# Altium schematic sheet RFDesign.SchDoc
size Letter
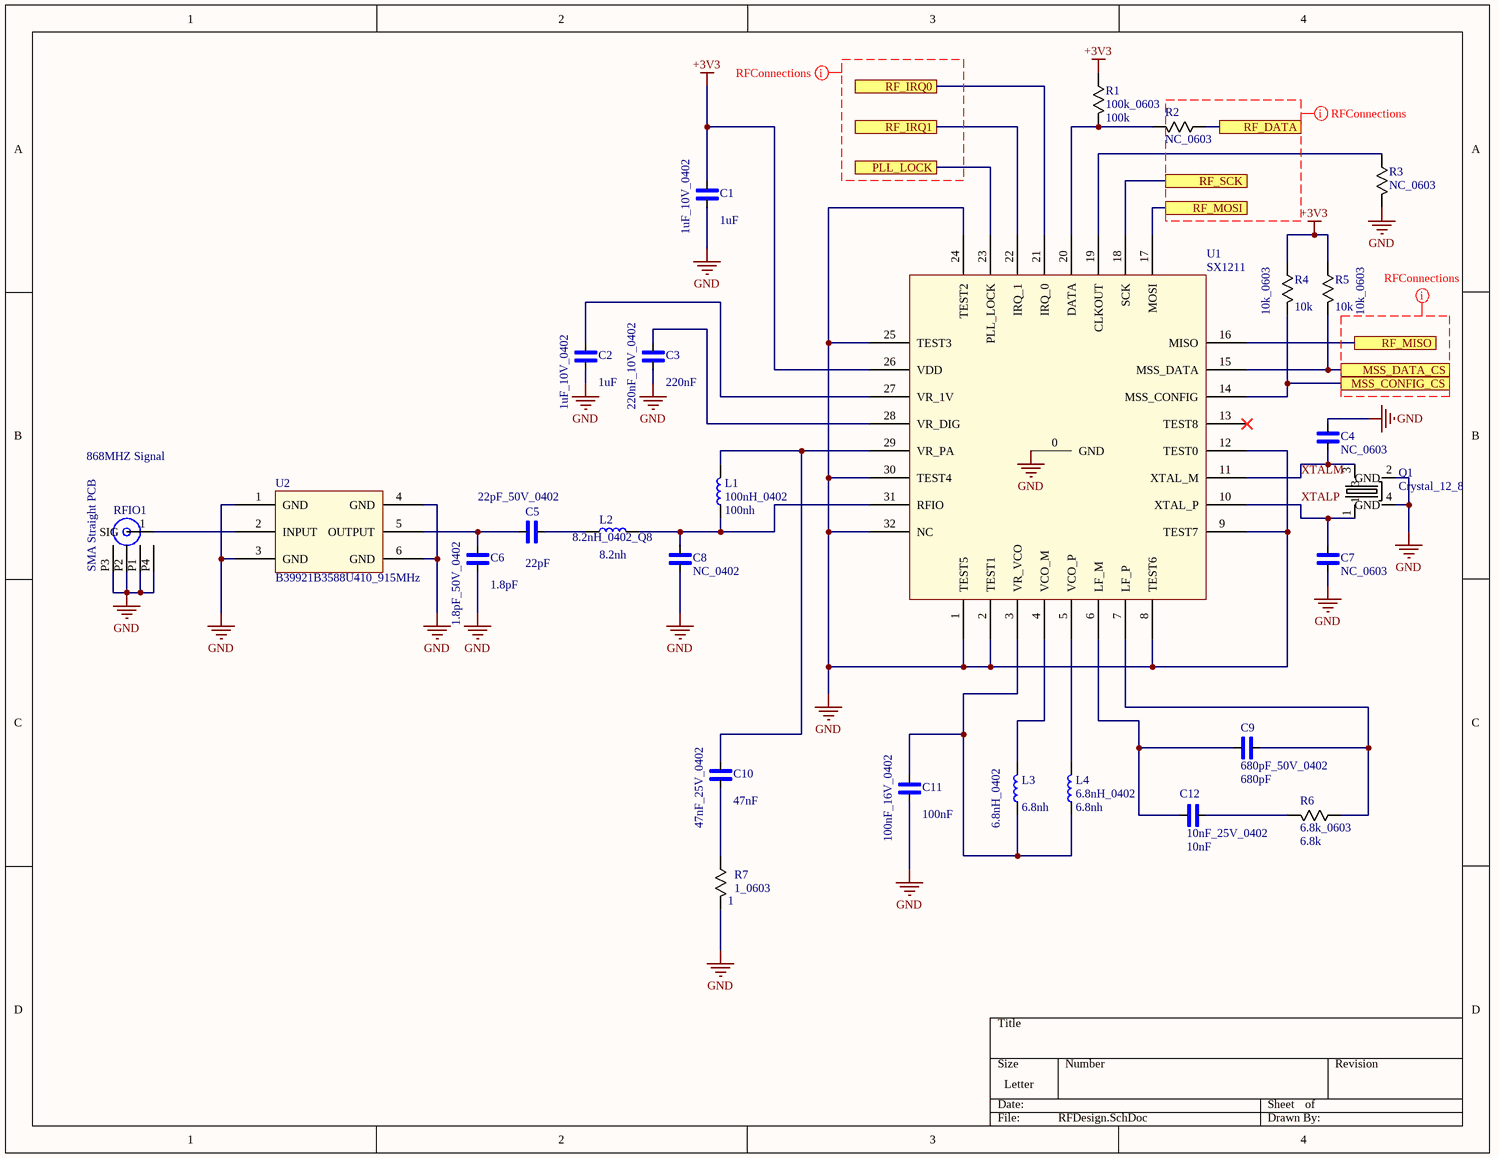
[diagram p0: RFDesign.SchDoc]

## Parts
C1  1uF_10V_0402  Capacitance: 1uF  [0402]
C2  1uF_10V_0402  Capacitance: 1uF  [0402]
C3  220nF_10V_0402  Capacitance: 220nF  [0402]
C4  NC_0603  [0603]
C5  22pF_50V_0402  Capacitance: 22pF  [0402]
C6  1.8pF_50V_0402  Capacitance: 1.8pF  [0402]
C7  NC_0603  [0603]
C8  NC_0402  [0402]
C9  680pF_50V_0402  Capacitance: 680pF  [0402]
C10  47nF_25V_0402  Capacitance: 47nF  [0402]
C11  100nF_16V_0402  Capacitance: 100nF  [0402]
C12  10nF_25V_0402  Capacitance: 10nF  [0402]
L1  100nH_0402  Inductance: 100nh  [0402]
L2  8.2nH_0402_Q8  Inductance: 8.2nh  [0402]
L3  6.8nH_0402  Inductance: 6.8nh  [0402]
L4  6.8nH_0402  Inductance: 6.8nh  [0402]
Q1  Crystal_12_8  [4-SMD No Lead]
R1  100k_0603  Resistance: 100k  [0603]
R2  NC_0603  [0603]
R3  NC_0603  [0603]
R4  10k_0603  Resistance: 10k  [0603]
R5  10k_0603  Resistance: 10k  [0603]
R6  6.8k_0603  Resistance: 6.8k  [0603]
R7  1_0603  Resistance: 1  [0603]
RFIO1  SMA Straight PCB  [SMA Straight PCB]
U1  SX1211  [SX1211]
U2  B39921B3588U410_915MHz  [B39871B3715U410]

## Ports
MSS_CONFIG_CS, MSS_DATA_CS, PLL_LOCK, RF_DATA, RF_IRQ0, RF_IRQ1, RF_MISO, RF_MOSI, RF_SCK

## Nets
+3V3: C1.2 R1.2 R4.2 R5.2 U1.26(VDD)
GND: C1.1 C2.1 C3.1 C4.2 C6.1 C7.1 C8.1 C11.1 Q1.2(GND) Q1.4(GND) R3.1 R7.1 RFIO1.P1 RFIO1.P2 RFIO1.P3 RFIO1.P4 U1.0(GND) U1.1(TEST5) U1.2(TEST1) U1.8(TEST6) U1.9(TEST7) U1.12(TEST0) U1.24(TEST2) U1.25(TEST3) U1.30(TEST4) U1.32(NC) U2.1(GND) U2.3(GND) U2.4(GND) U2.6(GND)
MSS_CONFIG_CS: R4.1 U1.14(MSS_CONFIG) ; port MSS_CONFIG_CS
MSS_DATA_CS: R5.1 U1.15(MSS_DATA) ; port MSS_DATA_CS
PLL_LOCK: U1.23(PLL_LOCK) ; port PLL_LOCK
RF_DATA: R2.2 ; port RF_DATA
RF_IRQ0: U1.21(IRQ_0) ; port RF_IRQ0
RF_IRQ1: U1.22(IRQ_1) ; port RF_IRQ1
RF_MISO: U1.16(MISO) ; port RF_MISO
RF_MOSI: U1.17(MOSI) ; port RF_MOSI
RF_SCK: U1.18(SCK) ; port RF_SCK
XTALM: C4.1 Q1.3 U1.11(XTAL_M)
XTALP: C7.2 Q1.1 U1.10(XTAL_P)
NetC2_2: C2.2 U1.27(VR_1V)
NetC3_2: C3.2 U1.28(VR_DIG)
NetC5_1: C5.1 C6.2 U2.5(OUTPUT)
NetC5_2: C5.2 L2.1
NetC8_2: C8.2 L1.1 L2.2 U1.31(RFIO)
NetC9_1: C9.1 C12.1 U1.6(LF_M)
NetC9_2: C9.2 R6.2 U1.7(LF_P)
NetC10_1: C10.1 R7.2
NetC10_2: C10.2 L1.2 U1.29(VR_PA)
NetC11_2: C11.2 L3.1 L4.1 U1.3(VR_VCO)
NetC12_2: C12.2 R6.1
NetL3_2: L3.2 U1.4(VCO_M)
NetL4_2: L4.2 U1.5(VCO_P)
NetR1_1: R1.1 R2.1 U1.20(DATA)
NetR3_2: R3.2 U1.19(CLKOUT)
NetRFIO1_1: RFIO1.1(SIG) U2.2(INPUT)

Not connected (* = marked no-connect by the designer): U1 13(TEST8)*

## Layout directives
net class RFNETS: (no net found under the mark)

## Notes on the sheet
- 868MHZ Signal

## Library data of the parts
C1 C2 = 1uF_10V_0402: Manufacturer: Murata; Manufacturer Part Number: GRM155R61A105KE15D; Tolerance: 20%; Dielectric: X5R; Voltage Rating: 10V; Supplier 1: Digi-Key; Stock 1: 0; Mount: Surface Mount; Case/Package: 0402; Number of Pins: 2; Case Code (Metric): 1005; Case Code (Imperial): 0402; Min Operating Temperature: -55°C; Max Operating Temperature: 85°C; Packaging: Tape and Reel; Package Quantity: 1; Voltage Rating (DC): 10V; Termination: SMD/SMT; Voltage: 10V; Length: 1mm; Height: 0.5mm; Width: 0.02inch; Thickness: 0.022inch; Depth: 0.5mm; Radiation Hardening: No; REACH SVHC: Unknown; Lead Free: Lead Free; ComponentLink1URL: https://datasheet.ciiva.com/28584/415291-28584208.pdf; ComponentLink1Description: https://datasheet.ciiva.com/28584/415291-28584208.pdf; ComponentLink2URL: https://datasheet.ciiva.com/132/product-132370.pdf; ComponentLink2Description: https://datasheet.ciiva.com/132/product-132370.pdf; ComponentLink3URL: https://datasheet.ciiva.com/132/partnumbering-e-01-132371.pdf; ComponentLink3Description: https://datasheet.ciiva.com/132/partnumbering-e-01-132371.pdf; ComponentLink4URL: https://datasheet.ciiva.com/132/partnumbering-e-01-132372.pdf; ComponentLink4Description: https://datasheet.ciiva.com/132/partnumbering-e-01-132372.pdf; ComponentLink5URL: https://datasheet.ciiva.com/22771/1747437-22771830.pdf; ComponentLink5Description: https://datasheet.ciiva.com/22771/1747437-22771830.pdf; ComponentLink6URL: https://datasheet.ciiva.com/11789/0900766b80ef921d-11789095.pdf; ComponentLink6Description: https://datasheet.ciiva.com/11789/0900766b80ef921d-11789095.pdf; ComponentLink7URL: https://datasheet.ciiva.com/18184/getdatasheetpartid-131022-18184586.pdf; ComponentLink7Description: https://datasheet.ciiva.com/18184/getdatasheetpartid-131022-18184586.pdf; ComponentLink8URL: https://datasheet.ciiva.com/16199/product-16199037.pdf; ComponentLink8Description: https://datasheet.ciiva.com/16199/product-16199037.pdf; Supplier Part Number 1: 490-3890-6-ND
C3 = 220nF_10V_0402: Manufacturer: Murata; Manufacturer Part Number: GRM155R61A224KE19J; Tolerance: 10%; Voltage Rating (DC): 10V; Dielectric: X5R; Supplier 1: Digi-Key; Stock 1: 0; Mount: Surface Mount; Case/Package: 0402; Case Code (Metric): 1005; Case Code (Imperial): 0402; Min Operating Temperature: -55°C; Max Operating Temperature: 85°C; Packaging: Tape and Reel; Package Quantity: 50000; Voltage Rating: 10V; Termination: SMD/SMT; Voltage: 10V; Length: 1mm; Height: 0.5mm; Width: 0.02inch; Thickness: 0.022inch; Depth: 0.5mm; Radiation Hardening: No; ComponentLink1URL: https://datasheet.ciiva.com/18184/getdatasheetpartid-494815-18184597.pdf; ComponentLink1Description: https://datasheet.ciiva.com/18184/getdatasheetpartid-494815-18184597.pdf; ComponentLink2URL: https://datasheet.ciiva.com/6270/grm155r61a224ke19-01-6270775.pdf; ComponentLink2Description: https://datasheet.ciiva.com/6270/grm155r61a224ke19-01-6270775.pdf; ComponentLink3URL: https://datasheet.ciiva.com/6270/grm155r61a224ke19-01-6270776.pdf; ComponentLink3Description: https://datasheet.ciiva.com/6270/grm155r61a224ke19-01-6270776.pdf; ComponentLink4URL: https://datasheet.ciiva.com/6270/grm155r61a224ke19-01-6270777.pdf; ComponentLink4Description: https://datasheet.ciiva.com/6270/grm155r61a224ke19-01-6270777.pdf; Supplier Part Number 1: GRM155R61A224KE19J-ND
C5 = 22pF_50V_0402: Manufacturer: Murata; Manufacturer Part Number: GRM1555C1H220JA01D; Material: Ceramic; Tolerance: 5%; Dielectric: C0G; Voltage Rating: 50V; Supplier 1: Digi-Key; Stock 1: 0; Pricing 1: 10000=0.00263 (USD); Mount: Surface Mount; Case/Package: 0402; Case Code (Metric): 1005; Case Code (Imperial): 0402; Min Operating Temperature: -55°C; Max Operating Temperature: 125°C; Packaging: Tape and Reel; Voltage Rating (DC): 50V; Package Quantity: 10000; Termination: SMD/SMT; Voltage: 50V; Length: 1mm; Height: 0.5mm; Width: 0.02inch; Thickness: 0.022inch; Depth: 0.5mm; Radiation Hardening: No; REACH SVHC: No SVHC; Lead Free: Lead Free; ComponentLink1URL: https://datasheet.ciiva.com/6277/product-6277809.pdf; ComponentLink1Description: https://datasheet.ciiva.com/6277/product-6277809.pdf; ComponentLink2URL: https://datasheet.ciiva.com/16440/l0005e-16440552.pdf; ComponentLink2Description: https://datasheet.ciiva.com/16440/l0005e-16440552.pdf; ComponentLink3URL: https://datasheet.ciiva.com/18184/getdatasheetpartid-316063-18184267.pdf; ComponentLink3Description: https://datasheet.ciiva.com/18184/getdatasheetpartid-316063-18184267.pdf; ComponentLink4URL: https://datasheet.ciiva.com/7828/1666664-7828846.pdf; ComponentLink4Description: https://datasheet.ciiva.com/7828/1666664-7828846.pdf; ComponentLink5URL: https://datasheet.ciiva.com/29200/453714-da-01-en-vs-kondensator-0402-29200051.pdf; ComponentLink5Description: https://datasheet.ciiva.com/29200/453714-da-01-en-vs-kondensator-0402-29200051.pdf; Supplier Part Number 1: 490-5868-2-ND
C6 = 1.8pF_50V_0402: Manufacturer: Murata; Manufacturer Part Number: GRM1555C1H1R8CA01D; Material: Ceramic; Dielectric: C0G; Voltage Rating (DC): 50V; Temperature Coefficient: 30ppm/°C; Supplier 1: Digi-Key; Stock 1: 0; Pricing 1: 10000=0.00604 (USD); Mount: Surface Mount; Case/Package: 0402; Number of Pins: 2; Case Code (Imperial): 0402; Case Code (Metric): 1005; Min Operating Temperature: -55°C; Max Operating Temperature: 125°C; Packaging: Tape and Reel; Package Quantity: 1; Voltage Rating: 50V; Termination: SMD/SMT; Voltage: 50V; Length: 1mm; Height: 0.5mm; Width: 0.5mm; Thickness: 0.022inch; Depth: 0.5mm; Radiation Hardening: No; REACH SVHC: No SVHC; Lead Free: Lead Free; ComponentLink1URL: https://datasheet.ciiva.com/5419/product-5419152.pdf; ComponentLink1Description: https://datasheet.ciiva.com/5419/product-5419152.pdf; ComponentLink2URL: https://datasheet.ciiva.com/16440/product-16440549.pdf; ComponentLink2Description: https://datasheet.ciiva.com/16440/product-16440549.pdf; ComponentLink3URL: https://datasheet.ciiva.com/11789/0900766b80ef921d-11789062.pdf; ComponentLink3Description: https://datasheet.ciiva.com/11789/0900766b80ef921d-11789062.pdf; ComponentLink4URL: https://datasheet.ciiva.com/6277/partnumbering-e-01-6277802.pdf; ComponentLink4Description: https://datasheet.ciiva.com/6277/partnumbering-e-01-6277802.pdf; ComponentLink5URL: https://datasheet.ciiva.com/6277/partnumbering-e-01-6277803.pdf; ComponentLink5Description: https://datasheet.ciiva.com/6277/partnumbering-e-01-6277803.pdf; ComponentLink6URL: https://datasheet.ciiva.com/6277/partnumbering-e-01-6277804.pdf; ComponentLink6Description: https://datasheet.ciiva.com/6277/partnumbering-e-01-6277804.pdf; ComponentLink7URL: https://datasheet.ciiva.com/7828/608985-7828844.pdf; ComponentLink7Description: https://datasheet.ciiva.com/7828/608985-7828844.pdf; ComponentLink8URL: https://datasheet.ciiva.com/11615/product-11615613.pdf; ComponentLink8Description: https://datasheet.ciiva.com/11615/product-11615613.pdf; ComponentLink9URL: https://datasheet.ciiva.com/17451/product-17451549.pdf; ComponentLink9Description: https://datasheet.ciiva.com/17451/product-17451549.pdf; ComponentLink10URL: https://datasheet.ciiva.com/18184/getdatasheetpartid-356626-18184255.pdf; ComponentLink10Description: https://datasheet.ciiva.com/18184/getdatasheetpartid-356626-18184255.pdf; ComponentLink11URL: https://datasheet.ciiva.com/22698/608985-22698399.pdf; ComponentLink11Description: https://datasheet.ciiva.com/22698/608985-22698399.pdf; ComponentLink12URL: https://datasheet.ciiva.com/29200/453701-da-01-en-vs-kondensator-0402-29200043.pdf; ComponentLink12Description: https://datasheet.ciiva.com/29200/453701-da-01-en-vs-kondensator-0402-29200043.pdf; Supplier Part Number 1: 490-5898-2-ND
C9 = 680pF_50V_0402: Manufacturer: Murata; Manufacturer Part Number: GRM1555C1H681JA01D; Material: Ceramic; Tolerance: 5%; Dielectric: C0G; Voltage Rating: 50V; Temperature Coefficient: 30ppm/°C; Insulation Resistance: 10GR; Supplier 1: Digi-Key; Stock 1: 80000; Pricing 1: 10000=0.00924 (USD); Mount: Surface Mount; Case/Package: 0402; Number of Pins: 2; Case Code (Metric): 1005; Case Code (Imperial): 0402; Dielectric Material: Ceramic; Min Operating Temperature: -55°C; Max Operating Temperature: 125°C; Voltage Rating (DC): 50V; Packaging: Tape and Reel; Package Quantity: 1; Termination: SMD/SMT; Voltage: 50V; Length: 1mm; Height: 0.5mm; Width: 0.5mm; Thickness: 0.022inch; Depth: 0.5mm; Radiation Hardening: No; REACH SVHC: No SVHC; Lead Free: Lead Free; ComponentLink1URL: https://datasheet.ciiva.com/131/product-131972.pdf; ComponentLink1Description: https://datasheet.ciiva.com/131/product-131972.pdf; ComponentLink2URL: https://datasheet.ciiva.com/18184/getdatasheetpartid-153035-18184453.pdf; ComponentLink2Description: https://datasheet.ciiva.com/18184/getdatasheetpartid-153035-18184453.pdf; ComponentLink3URL: https://datasheet.ciiva.com/131/grm1555c1h681ja01-01-131974.pdf; ComponentLink3Description: https://datasheet.ciiva.com/131/grm1555c1h681ja01-01-131974.pdf; ComponentLink4URL: https://datasheet.ciiva.com/14116/grmseries-tc-hitype-eng-14116902.pdf; ComponentLink4Description: https://datasheet.ciiva.com/14116/grmseries-tc-hitype-eng-14116902.pdf; ComponentLink5URL: https://datasheet.ciiva.com/11786/0900766b807a1cab-11786505.pdf; ComponentLink5Description: https://datasheet.ciiva.com/11786/0900766b807a1cab-11786505.pdf; ComponentLink6URL: https://datasheet.ciiva.com/14116/grmseries-tc-hitype-eng-14116841.pdf; ComponentLink6Description: https://datasheet.ciiva.com/14116/grmseries-tc-hitype-eng-14116841.pdf; ComponentLink7URL: https://datasheet.ciiva.com/7828/4360-7828879.pdf; ComponentLink7Description: https://datasheet.ciiva.com/7828/4360-7828879.pdf; ComponentLink8URL: https://datasheet.ciiva.com/29199/453978-da-01-en-vs-kondensator-0402-29199870.pdf; ComponentLink8Description: https://datasheet.ciiva.com/29199/453978-da-01-en-vs-kondensator-0402-29199870.pdf; Supplier Part Number 1: 490-3240-2-ND
C10 = 47nF_25V_0402: Manufacturer: Murata; Manufacturer Part Number: GRM155R71E473KA88J; Tolerance: 10%; Voltage Rating: 25V; Dielectric: X7R; Supplier 1: Digi-Key; Stock 1: 0; Mount: Surface Mount; Case/Package: 0402; Case Code (Metric): 1005; Case Code (Imperial): 0402; Min Operating Temperature: -55°C; Max Operating Temperature: 125°C; Package Quantity: 50000; Packaging: Tape and Reel; Voltage Rating (DC): 25V; Termination: SMD/SMT; Length: 1mm; Height: 0.5mm; Width: 0.02inch; Thickness: 0.022inch; Depth: 0.5mm; Radiation Hardening: No; ComponentLink1URL: https://datasheet.ciiva.com/6263/grm155r71e473ka88-01-6263782.pdf; ComponentLink1Description: https://datasheet.ciiva.com/6263/grm155r71e473ka88-01-6263782.pdf; Supplier Part Number 1: GRM155R71E473KA88J-ND
C11 = 100nF_16V_0402: Manufacturer: Murata; Manufacturer Part Number: GRM155-R7-1C-104K-A88-D; Material: Ceramic; Tolerance: 10%; Dielectric: X7R; Voltage Rating: 16V; Insulation Resistance: 10GR; Supplier 1: Digi-Key; Stock 1: 0; Pricing 1: 10000=0.00263 (USD); Mount: Surface Mount; Case/Package: 0402; Number of Pins: 2; Case Code (Metric): 1005; Case Code (Imperial): 0402; Dielectric Material: Ceramic; Min Operating Temperature: -55°C; Max Operating Temperature: 125°C; Packaging: Tape and Reel; Voltage Rating (DC): 16V; Package Quantity: 1; Termination: SMD/SMT; Voltage: 16V; Length: 1mm; Height: 0.5mm; Width: 0.5mm; Thickness: 0.022inch; Depth: 0.5mm; Radiation Hardening: No; REACH SVHC: No SVHC; Lead Free: Lead Free; ComponentLink1URL: https://datasheet.ciiva.com/28534/4360-28534133.pdf; ComponentLink1Description: https://datasheet.ciiva.com/28534/4360-28534133.pdf; ComponentLink2URL: https://datasheet.ciiva.com/14103/grmseries-highdielectrictype-eng-14103750.pdf; ComponentLink2Description: https://datasheet.ciiva.com/14103/grmseries-highdielectrictype-eng-14103750.pdf; ComponentLink3URL: https://datasheet.ciiva.com/16199/product-16199000.pdf; ComponentLink3Description: https://datasheet.ciiva.com/16199/product-16199000.pdf; ComponentLink4URL: https://datasheet.ciiva.com/18102/getdatasheetpartid-85307-18102905.pdf; ComponentLink4Description: https://datasheet.ciiva.com/18102/getdatasheetpartid-85307-18102905.pdf; ComponentLink5URL: https://datasheet.ciiva.com/129/grm155r71c104ka88-01-129739.pdf; ComponentLink5Description: https://datasheet.ciiva.com/129/grm155r71c104ka88-01-129739.pdf; ComponentLink6URL: https://datasheet.ciiva.com/129/grm155r71c104ka88-01-129740.pdf; ComponentLink6Description: https://datasheet.ciiva.com/129/grm155r71c104ka88-01-129740.pdf; ComponentLink7URL: https://datasheet.ciiva.com/14116/grmseries-highdielectrictype-eng-14116878.pdf; ComponentLink7Description: https://datasheet.ciiva.com/14116/grmseries-highdielectrictype-eng-14116878.pdf; ComponentLink8URL: https://datasheet.ciiva.com/7937/4360-7937615.pdf; ComponentLink8Description: https://datasheet.ciiva.com/7937/4360-7937615.pdf; ComponentLink9URL: https://datasheet.ciiva.com/28534/4360-28534127.pdf; ComponentLink9Description: https://datasheet.ciiva.com/28534/4360-28534127.pdf; ComponentLink10URL: https://datasheet.ciiva.com/29199/454098-da-01-en-vs-kondensator-0402-29199799.pdf; ComponentLink10Description: https://datasheet.ciiva.com/29199/454098-da-01-en-vs-kondensator-0402-29199799.pdf; Supplier Part Number 1: 490-3261-2-ND
C12 = 10nF_25V_0402: Manufacturer: Murata; Manufacturer Part Number: GRM155R71E103KA01D; Material: Ceramic; Tolerance: 10%; Dielectric: X7R; Voltage Rating: 25V; Insulation Resistance: 10GR; Supplier 1: Future Electronics; Stock 1: 0; Mount: Surface Mount; Case/Package: 0402; Number of Pins: 2; Case Code (Imperial): 0402; Case Code (Metric): 1005; Dielectric Material: Ceramic; Min Operating Temperature: -55°C; Max Operating Temperature: 125°C; Packaging: Tape and Reel; Voltage Rating (DC): 25V; Package Quantity: 1; Termination: SMD/SMT; Voltage: 25V; Length: 1mm; Height: 0.5mm; Width: 0.5mm; Thickness: 0.022inch; Depth: 0.5mm; Radiation Hardening: No; REACH SVHC: No SVHC; Lead Free: Lead Free; ComponentLink1URL: https://datasheet.ciiva.com/11786/0900766b807a1cab-11786320.pdf; ComponentLink1Description: https://datasheet.ciiva.com/11786/0900766b807a1cab-11786320.pdf; ComponentLink2URL: https://datasheet.ciiva.com/18184/getdatasheetpartid-161489-18184689.pdf; ComponentLink2Description: https://datasheet.ciiva.com/18184/getdatasheetpartid-161489-18184689.pdf; ComponentLink3URL: https://datasheet.ciiva.com/28534/1699889-28534148.pdf; ComponentLink3Description: https://datasheet.ciiva.com/28534/1699889-28534148.pdf; ComponentLink4URL: https://datasheet.ciiva.com/7937/1747448-7937621.pdf; ComponentLink4Description: https://datasheet.ciiva.com/7937/1747448-7937621.pdf; ComponentLink5URL: https://datasheet.ciiva.com/16199/product-16199034.pdf; ComponentLink5Description: https://datasheet.ciiva.com/16199/product-16199034.pdf; ComponentLink6URL: https://datasheet.ciiva.com/3777/3813grm155r71e103ka0123-3777115.pdf; ComponentLink6Description: https://datasheet.ciiva.com/3777/3813grm155r71e103ka0123-3777115.pdf; ComponentLink7URL: https://datasheet.ciiva.com/129/partnumbering-e-01-129741.pdf; ComponentLink7Description: https://datasheet.ciiva.com/129/partnumbering-e-01-129741.pdf; ComponentLink8URL: https://datasheet.ciiva.com/129/partnumbering-e-01-129742.pdf; ComponentLink8Description: https://datasheet.ciiva.com/129/partnumbering-e-01-129742.pdf; ComponentLink9URL: https://datasheet.ciiva.com/129/partnumbering-e-01-129743.pdf; ComponentLink9Description: https://datasheet.ciiva.com/129/partnumbering-e-01-129743.pdf; ComponentLink10URL: https://datasheet.ciiva.com/29199/454154-da-01-en-vs-kondensator-0402-29199817.pdf; ComponentLink10Description: https://datasheet.ciiva.com/29199/454154-da-01-en-vs-kondensator-0402-29199817.pdf; Supplier Part Number 1: GRM155R71E103KA01D
L1 = 100nH_0402: Manufacturer: Murata; Manufacturer Part Number: LQW15ANR10J00D; Core Material: Ferrite,Air; Tolerance: 5%; Max DC Current: 120mA; DC Resistance (DCR): 2.52R; Self Resonant Frequency: 1.5GHz; Shielding: Unshielded; Test Frequency: 100MHz; Supplier 1: Digi-Key; Stock 1: 160000; Pricing 1: 10000=0.048, 30000=0.0465, 50000=0.045, 100000=0.0435 (USD); Mount: Surface Mount; Case/Package: 0402; Number of Pins: 2; Weight: 2.8E-05oz; Case Code (Metric): 1005; Case Code (Imperial): 0402; Min Operating Temperature: -55°C; Max Operating Temperature: 125°C; Packaging: Tape and Reel; Package Quantity: 10000; Current Rating: 120mA; Inductance Tolerance: 5%; Termination: SMD/SMT; DC Current: 120mA; Military Standard: Not; Length: 1mm; Height: 0.5mm; Width: 0.5mm; Depth: 0.6mm; Radiation Hardening: No; REACH SVHC: No SVHC; Lead Free: Lead Free; ComponentLink1URL: https://datasheet.ciiva.com/18088/getdatasheetpartid-55782-18088805.pdf; ComponentLink1Description: https://datasheet.ciiva.com/18088/getdatasheetpartid-55782-18088805.pdf; ComponentLink2URL: https://datasheet.ciiva.com/17247/l0075s0080lqw15a-00-17247734.pdf; ComponentLink2Description: https://datasheet.ciiva.com/17247/l0075s0080lqw15a-00-17247734.pdf; ComponentLink3URL: https://datasheet.ciiva.com/16293/l0075s0080lqw15a-00-16293049.pdf; ComponentLink3Description: https://datasheet.ciiva.com/16293/l0075s0080lqw15a-00-16293049.pdf; ComponentLink4URL: https://datasheet.ciiva.com/4977/product-4977354.pdf; ComponentLink4Description: https://datasheet.ciiva.com/4977/product-4977354.pdf; ComponentLink5URL: https://datasheet.ciiva.com/1042/l0075s0080lqw15a-00-1042204.pdf; ComponentLink5Description: https://datasheet.ciiva.com/1042/l0075s0080lqw15a-00-1042204.pdf; ComponentLink6URL: https://datasheet.ciiva.com/1042/l0075s0080lqw15a-00-1042205.pdf; ComponentLink6Description: https://datasheet.ciiva.com/1042/l0075s0080lqw15a-00-1042205.pdf; ComponentLink7URL: https://datasheet.ciiva.com/8507/l0075s0080lqw15a-00-8507421.pdf; ComponentLink7Description: https://datasheet.ciiva.com/8507/l0075s0080lqw15a-00-8507421.pdf; ComponentLink8URL: https://datasheet.ciiva.com/1042/l0075s0080lqw15a-00-1042206.pdf; ComponentLink8Description: https://datasheet.ciiva.com/1042/l0075s0080lqw15a-00-1042206.pdf; ComponentLink9URL: https://datasheet.ciiva.com/11799/0900766b8090d800-11799038.pdf; ComponentLink9Description: https://datasheet.ciiva.com/11799/0900766b8090d800-11799038.pdf; Supplier Part Number 1: 490-4090-2-ND
L2 = 8.2nH_0402_Q8: Manufacturer: Murata; Manufacturer Part Number: LQG15HS8N2J02D; Core Material: Air; Tolerance: 5%; DC Resistance (DCR): 240mR; Max DC Current: 300mA; Shielding: Unshielded; Q Factor: 8; Self Resonant Frequency: 3.7GHz; Test Frequency: 100MHz; Supplier 1: Future Electronics; Stock 1: 0; Pricing 1: 2000=0.0218 (USD); Mount: Surface Mount; Case/Package: 0402; Weight: 2.3E-05oz; Case Code (Metric): 1005; Case Code (Imperial): 0402; Min Operating Temperature: -55°C; Max Operating Temperature: 125°C; Package Quantity: 10000; Current Rating: 300mA; Packaging: Tape and Reel; Termination: SMD/SMT; DC Current: 300mA; Military Standard: Not; Length: 1mm; Height: 0.5mm; Width: 0.02inch; Height - Seated (Max): 0.022inch; Depth: 0.55mm; Radiation Hardening: No; Lead Free: Lead Free; ComponentLink1URL: https://datasheet.ciiva.com/1038/l0075s0083lqg15hs-1038112.pdf; ComponentLink1Description: https://datasheet.ciiva.com/1038/l0075s0083lqg15hs-1038112.pdf; ComponentLink2URL: https://datasheet.ciiva.com/1038/l0075s0083lqg15hs-1038113.pdf; ComponentLink2Description: https://datasheet.ciiva.com/1038/l0075s0083lqg15hs-1038113.pdf; ComponentLink3URL: https://datasheet.ciiva.com/1038/l0075s0083lqg15hs-1038114.pdf; ComponentLink3Description: https://datasheet.ciiva.com/1038/l0075s0083lqg15hs-1038114.pdf; ComponentLink4URL: https://datasheet.ciiva.com/16208/l0075s0083lqg15hs-16208342.pdf; ComponentLink4Description: https://datasheet.ciiva.com/16208/l0075s0083lqg15hs-16208342.pdf; ComponentLink5URL: https://datasheet.ciiva.com/11799/0900766b8090d685-11799047.pdf; ComponentLink5Description: https://datasheet.ciiva.com/11799/0900766b8090d685-11799047.pdf; ComponentLink6URL: https://datasheet.ciiva.com/17247/l0075s0083lqg15hs-17247128.pdf; ComponentLink6Description: https://datasheet.ciiva.com/17247/l0075s0083lqg15hs-17247128.pdf; ComponentLink7URL: https://datasheet.ciiva.com/8510/l0075s0083lqg15hs-8510877.pdf; ComponentLink7Description: https://datasheet.ciiva.com/8510/l0075s0083lqg15hs-8510877.pdf; Supplier Part Number 1: LQG15HS8N2J02D
L3 L4 = 6.8nH_0402: Manufacturer: Murata; Manufacturer Part Number: LQW15AN6N8H00D; Core Material: Ferrite,Air,Non-Magnetic; Tolerance: 3%; DC Resistance (DCR): 90mR; Max DC Current: 700mA; Shielding: Unshielded; Q Factor: 25; Current: 540mA; Self Resonant Frequency: 6GHz; Test Frequency: 100MHz; Supplier 1: Digi-Key; Stock 1: 0; Mount: Surface Mount; Case/Package: 0402; Weight: 2.8E-05oz; Case Code (Metric): 1005; Case Code (Imperial): 0402; Min Operating Temperature: -55°C; Max Operating Temperature: 125°C; Packaging: Tape and Reel; Package Quantity: 10000; Current Rating: 700mA; Composition: Wirewound; Termination: SMD/SMT; DC Current: 700mA; Military Standard: Not; Length: 1mm; Height: 0.5mm; Depth: 0.7mm; Width: 0.02inch; Height - Seated (Max): 0.024inch; Radiation Hardening: No; ComponentLink1URL: https://datasheet.ciiva.com/11799/0900766b8090d800-11799106.pdf; ComponentLink1Description: https://datasheet.ciiva.com/11799/0900766b8090d800-11799106.pdf; ComponentLink2URL: https://datasheet.ciiva.com/4978/product-4978581.pdf; ComponentLink2Description: https://datasheet.ciiva.com/4978/product-4978581.pdf; ComponentLink3URL: https://datasheet.ciiva.com/6705/l0075s0080lqw15a-00-6705397.pdf; ComponentLink3Description: https://datasheet.ciiva.com/6705/l0075s0080lqw15a-00-6705397.pdf; ComponentLink4URL: https://datasheet.ciiva.com/17278/l0075s0080lqw15a-00-17278535.pdf; ComponentLink4Description: https://datasheet.ciiva.com/17278/l0075s0080lqw15a-00-17278535.pdf; ComponentLink5URL: https://datasheet.ciiva.com/8507/l0075s0080lqw15a-00-8507663.pdf; ComponentLink5Description: https://datasheet.ciiva.com/8507/l0075s0080lqw15a-00-8507663.pdf; Supplier Part Number 1: LQW15AN6N8H00D-ND
Q1 = Crystal_12_8: CRYSTAL 12.8000MHZ 10PF SMD; Part No: ABM3B-12.800MHZ-10-1-U-T
R1 = 100k_0603: Manufacturer: Vishay; Manufacturer Part Number: CRCW0603100KFKEA; Tolerance: 1%; Power Rating: 100mW; Voltage Rating: 75V; Temperature Coefficient: 100ppm/°C; Supplier 1: Future Electronics; Stock 1: 0; Case/Package: 0603; Number of Pins: 2; Weight: 7.1E-05oz; Case Code (Metric): 1608; Case Code (Imperial): 0603; Contact Plating: Tin,Lead; Min Operating Temperature: -55°C; Max Operating Temperature: 155°C; Packaging: Tape and Reel; Termination: SMD/SMT; Package Quantity: 10; Composition: Thick Film; Military Standard: Not; Max Power Dissipation: 100mW; Number of Terminations: 2; Voltage Rating (DC): 75V; Length: 1.55mm; Height: 0.45mm; Width: 0.033inch; Depth: 0.85mm; Radiation Hardening: No; REACH SVHC: Unknown; Lead Free: Lead Free; ComponentLink1URL: https://datasheet.ciiva.com/2465/dcrcwe3-2465525.pdf; ComponentLink1Description: https://datasheet.ciiva.com/2465/dcrcwe3-2465525.pdf; ComponentLink2URL: https://datasheet.ciiva.com/7777/1697337-7777269.pdf; ComponentLink2Description: https://datasheet.ciiva.com/7777/1697337-7777269.pdf; ComponentLink3URL: https://datasheet.ciiva.com/15159/getdatasheetpartid-93113-15159925.pdf; ComponentLink3Description: https://datasheet.ciiva.com/15159/getdatasheetpartid-93113-15159925.pdf; ComponentLink4URL: https://datasheet.ciiva.com/46441/1720486-46441605.pdf; ComponentLink4Description: https://datasheet.ciiva.com/46441/1720486-46441605.pdf; ComponentLink5URL: https://datasheet.ciiva.com/2465/dcrcwe3-2465526.pdf; ComponentLink5Description: https://datasheet.ciiva.com/2465/dcrcwe3-2465526.pdf; ComponentLink6URL: https://datasheet.ciiva.com/2465/dcrcwe3-2465527.pdf; ComponentLink6Description: https://datasheet.ciiva.com/2465/dcrcwe3-2465527.pdf; ComponentLink7URL: https://datasheet.ciiva.com/8340/dcrcwe3-8340199.pdf; ComponentLink7Description: https://datasheet.ciiva.com/8340/dcrcwe3-8340199.pdf; ComponentLink8URL: https://datasheet.ciiva.com/16725/70201119-16725223.pdf; ComponentLink8Description: https://datasheet.ciiva.com/16725/70201119-16725223.pdf; ComponentLink9URL: https://datasheet.ciiva.com/8340/dcrcwe3-8340201.pdf; ComponentLink9Description: https://datasheet.ciiva.com/8340/dcrcwe3-8340201.pdf; ComponentLink10URL: https://datasheet.ciiva.com/7791/66915-7791994.pdf; ComponentLink10Description: https://datasheet.ciiva.com/7791/66915-7791994.pdf; ComponentLink11URL: https://datasheet.ciiva.com/5545/dcrcwe3-109170-5545100.pdf; ComponentLink11Description: https://datasheet.ciiva.com/5545/dcrcwe3-109170-5545100.pdf; ComponentLink12URL: https://datasheet.ciiva.com/11809/0900766b80d98afc-11809004.pdf; ComponentLink12Description: https://datasheet.ciiva.com/11809/0900766b80d98afc-11809004.pdf; ComponentLink13URL: https://datasheet.ciiva.com/26317/fld-crcw-e3-data-en-26317165.pdf; ComponentLink13Description: https://datasheet.ciiva.com/26317/fld-crcw-e3-data-en-26317165.pdf; ComponentLink14URL: https://datasheet.ciiva.com/16941/dcrcw-16941311.pdf; ComponentLink14Description: https://datasheet.ciiva.com/16941/dcrcw-16941311.pdf; Supplier Part Number 1: CRCW0603100KFKEA
R2 R3 = NC_0603: Resistance: NC
R4 R5 = 10k_0603: Manufacturer: Panasonic; Manufacturer Part Number: ERJ-3EKF1002V; Tolerance: 1%; Max Power Dissipation: 100mW; Temperature Coefficient: 100ppm/°C; Voltage Rating: 75V; Supplier 1: Digi-Key; Stock 1: 0; Pricing 1: 5000=0.00751, 10000=0.00653, 25000=0.00573, 50000=0.00526, 125000=0.00515 (USD); Mount: Surface Mount; Case/Package: 0603; Number of Pins: 2; Case Code (Metric): 1608; Case Code (Imperial): 0603; Contact Plating: Tin; Min Operating Temperature: -55°C; Max Operating Temperature: 155°C; Packaging: Tape and Reel; Power Rating: 100mW; Package Quantity: 1; Termination: SMD/SMT; Composition: Thick Film; Number of Terminations: 2; Military Standard: Not; Voltage Rating (DC): 75V; Length: 1.6mm; Height: 0.45mm; Depth: 0.8mm; Width: 0.031inch; Radiation Hardening: No; Lead Free: Lead Free; REACH SVHC: No SVHC; ComponentLink1URL: https://datasheet.ciiva.com/16511/aoa0000ce2-16511861.pdf; ComponentLink1Description: https://datasheet.ciiva.com/16511/aoa0000ce2-16511861.pdf; ComponentLink2URL: https://datasheet.ciiva.com/46372/1678782-46372725.pdf; ComponentLink2Description: https://datasheet.ciiva.com/46372/1678782-46372725.pdf; ComponentLink3URL: https://datasheet.ciiva.com/28514/426256-28514198.pdf; ComponentLink3Description: https://datasheet.ciiva.com/28514/426256-28514198.pdf; ComponentLink4URL: https://datasheet.ciiva.com/9194/aoa0000ce2-9194199.pdf; ComponentLink4Description: https://datasheet.ciiva.com/9194/aoa0000ce2-9194199.pdf; ComponentLink5URL: https://datasheet.ciiva.com/7830/aoa0000ce2-7830729.pdf; ComponentLink5Description: https://datasheet.ciiva.com/7830/aoa0000ce2-7830729.pdf; ComponentLink6URL: https://datasheet.ciiva.com/17212/aoa0000ce2-17212105.pdf; ComponentLink6Description: https://datasheet.ciiva.com/17212/aoa0000ce2-17212105.pdf; ComponentLink7URL: https://datasheet.ciiva.com/30208/aoa0000ce2-30208985.pdf; ComponentLink7Description: https://datasheet.ciiva.com/30208/aoa0000ce2-30208985.pdf; ComponentLink8URL: https://datasheet.ciiva.com/48530/aoa0000ce2-48530988.pdf; ComponentLink8Description: https://datasheet.ciiva.com/48530/aoa0000ce2-48530988.pdf; ComponentLink9URL: https://datasheet.ciiva.com/24070/aoa0000ce2-24070318.pdf; ComponentLink9Description: https://datasheet.ciiva.com/24070/aoa0000ce2-24070318.pdf; ComponentLink10URL: https://datasheet.ciiva.com/16759/70260748-16759807.pdf; ComponentLink10Description: https://datasheet.ciiva.com/16759/70260748-16759807.pdf; Supplier Part Number 1: P10.0KHTR-ND
R6 = 6.8k_0603: Manufacturer: Vishay; Manufacturer Part Number: CRCW06036K80FKEA; Tolerance: 1%; Power Rating: 100mW; Voltage Rating: 75V; Temperature Coefficient: 100ppm/°C; Supplier 1: Digi-Key; Stock 1: 0; Pricing 1: 5000=0.00497, 10000=0.00432, 25000=0.00405 (USD); Case/Package: 0603; Weight: 7.1E-05oz; Case Code (Metric): 1608; Case Code (Imperial): 0603; Contact Plating: Tin; Min Operating Temperature: -55°C; Max Operating Temperature: 155°C; Package Quantity: 10; Packaging: Tape and Reel; Termination: SMD/SMT; Max Power Dissipation: 100mW; Composition: Thick Film; Number of Terminations: 2; Military Standard: Not; Voltage Rating (DC): 75V; Length: 1.55mm; Height: 0.45mm; Width: 0.033inch; Depth: 0.85mm; Radiation Hardening: No; REACH SVHC: Unknown; Lead Free: Lead Free; ComponentLink1URL: https://datasheet.ciiva.com/11811/0900766b80d98afc-11811920.pdf; ComponentLink1Description: https://datasheet.ciiva.com/11811/0900766b80d98afc-11811920.pdf; ComponentLink2URL: https://datasheet.ciiva.com/2465/dcrcwe3-2465684.pdf; ComponentLink2Description: https://datasheet.ciiva.com/2465/dcrcwe3-2465684.pdf; ComponentLink3URL: https://datasheet.ciiva.com/2465/dcrcwe3-2465685.pdf; ComponentLink3Description: https://datasheet.ciiva.com/2465/dcrcwe3-2465685.pdf; ComponentLink4URL: https://datasheet.ciiva.com/2465/dcrcwe3-2465686.pdf; ComponentLink4Description: https://datasheet.ciiva.com/2465/dcrcwe3-2465686.pdf; ComponentLink5URL: https://datasheet.ciiva.com/26314/fld-crcw-e3-data-en-26314745.pdf; ComponentLink5Description: https://datasheet.ciiva.com/26314/fld-crcw-e3-data-en-26314745.pdf; ComponentLink6URL: https://datasheet.ciiva.com/16771/70201119-16771274.pdf; ComponentLink6Description: https://datasheet.ciiva.com/16771/70201119-16771274.pdf; ComponentLink7URL: https://datasheet.ciiva.com/22870/70201119-22870027.pdf; ComponentLink7Description: https://datasheet.ciiva.com/22870/70201119-22870027.pdf; ComponentLink8URL: https://datasheet.ciiva.com/3257/dcrcwe3-3257852.pdf; ComponentLink8Description: https://datasheet.ciiva.com/3257/dcrcwe3-3257852.pdf; ComponentLink9URL: https://datasheet.ciiva.com/7673/1697337-7673148.pdf; ComponentLink9Description: https://datasheet.ciiva.com/7673/1697337-7673148.pdf; ComponentLink10URL: https://datasheet.ciiva.com/3257/dcrcwe3-3257853.pdf; ComponentLink10Description: https://datasheet.ciiva.com/3257/dcrcwe3-3257853.pdf; ComponentLink11URL: https://datasheet.ciiva.com/16508/dcrcwe3-16508431.pdf; ComponentLink11Description: https://datasheet.ciiva.com/16508/dcrcwe3-16508431.pdf; Supplier Part Number 1: 541-6.80KHTR-ND
R7 = 1_0603: Manufacturer: Vishay Dale; Manufacturer Part Number: CRCW06031R00FKEA; Tolerance: 1%; Power Rating: 100mW; Temperature Coefficient: 100ppm/°C; Voltage Rating: 75V; ComponentLink1URL: https://datasheet.ciiva.com/16396/aoa0000ce3-16396837.pdf; ComponentLink1Description: https://datasheet.ciiva.com/16396/aoa0000ce3-16396837.pdf; ComponentLink2URL: https://datasheet.ciiva.com/28691/391509-28691973.pdf; ComponentLink2Description: https://datasheet.ciiva.com/28691/391509-28691973.pdf; ComponentLink3URL: https://datasheet.ciiva.com/16784/70068852-16784839.pdf; ComponentLink3Description: https://datasheet.ciiva.com/16784/70068852-16784839.pdf; ComponentLink4URL: https://datasheet.ciiva.com/9117/aoa0000ce3-9117368.pdf; ComponentLink4Description: https://datasheet.ciiva.com/9117/aoa0000ce3-9117368.pdf; ComponentLink5URL: https://datasheet.ciiva.com/11810/0900766b80eefa12-11810728.pdf; ComponentLink5Description: https://datasheet.ciiva.com/11810/0900766b80eefa12-11810728.pdf; ComponentLink6URL: https://datasheet.ciiva.com/24165/aoa0000ce3-72189-24165336.pdf; ComponentLink6Description: https://datasheet.ciiva.com/24165/aoa0000ce3-72189-24165336.pdf; ComponentLink7URL: https://datasheet.ciiva.com/30060/6aoa0000ce3-30060648.pdf; ComponentLink7Description: https://datasheet.ciiva.com/30060/6aoa0000ce3-30060648.pdf; ComponentLink8URL: https://datasheet.ciiva.com/6138/391509-6138777.pdf; ComponentLink8Description: https://datasheet.ciiva.com/6138/391509-6138777.pdf; ComponentLink9URL: https://datasheet.ciiva.com/16766/70068852-16766778.pdf; ComponentLink9Description: https://datasheet.ciiva.com/16766/70068852-16766778.pdf; ComponentLink10URL: https://datasheet.ciiva.com/16853/aoa0000ce3-16853436.pdf; ComponentLink10Description: https://datasheet.ciiva.com/16853/aoa0000ce3-16853436.pdf; ComponentLink11URL: https://datasheet.ciiva.com/43455/391509-43455868.pdf; ComponentLink11Description: https://datasheet.ciiva.com/43455/391509-43455868.pdf; ComponentLink12URL: https://datasheet.ciiva.com/28547/391509-28547230.pdf; ComponentLink12Description: https://datasheet.ciiva.com/28547/391509-28547230.pdf; Supplier 1: Digi-Key; Stock 1: 0; Pricing 1: 5000=0.00497, 10000=0.00432, 25000=0.00405 (USD); Mount: Surface Mount; Case/Package: 0603; Number of Pins: 2; Weight: 7.1E-05oz; Case Code (Metric): 1608; Case Code (Imperial): 0603; Contact Plating: Tin; Min Operating Temperature: -55°C; Max Operating Temperature: 155°C; Packaging: Tape and Reel; Composition: Thick Film; Voltage Rating (DC): 75V; Package Quantity: 10; Termination: SMD/SMT; Military Standard: Not; Number of Terminations: 2; Max Power Dissipation: 100mW; Length: 1.55mm; Height: 0.02inch; Width: 0.033inch; Depth: 0.85mm; Radiation Hardening: No; REACH SVHC: Unknown; Lead Free: Lead Free; ComponentLink13URL: https://datasheet.ciiva.com/7792/1359337-7792119.pdf; ComponentLink13Description: https://datasheet.ciiva.com/7792/1359337-7792119.pdf; ComponentLink14URL: https://datasheet.ciiva.com/2465/dcrcwe3-2465528.pdf; ComponentLink14Description: https://datasheet.ciiva.com/2465/dcrcwe3-2465528.pdf; ComponentLink15URL: https://datasheet.ciiva.com/2465/dcrcwe3-2465529.pdf; ComponentLink15Description: https://datasheet.ciiva.com/2465/dcrcwe3-2465529.pdf; ComponentLink16URL: https://datasheet.ciiva.com/3257/dcrcwe3-3257225.pdf; ComponentLink16Description: https://datasheet.ciiva.com/3257/dcrcwe3-3257225.pdf; ComponentLink17URL: https://datasheet.ciiva.com/2465/dcrcwe3-2465530.pdf; ComponentLink17Description: https://datasheet.ciiva.com/2465/dcrcwe3-2465530.pdf; ComponentLink18URL: https://datasheet.ciiva.com/3257/dcrcwe3-3257226.pdf; ComponentLink18Description: https://datasheet.ciiva.com/3257/dcrcwe3-3257226.pdf; ComponentLink19URL: https://datasheet.ciiva.com/16883/dcrcwe3-16883290.pdf; ComponentLink19Description: https://datasheet.ciiva.com/16883/dcrcwe3-16883290.pdf; ComponentLink20URL: https://datasheet.ciiva.com/16768/70201119-16768957.pdf; ComponentLink20Description: https://datasheet.ciiva.com/16768/70201119-16768957.pdf; ComponentLink21URL: https://datasheet.ciiva.com/28621/1747939-28621389.pdf; ComponentLink21Description: https://datasheet.ciiva.com/28621/1747939-28621389.pdf; ComponentLink22URL: https://datasheet.ciiva.com/5541/dcrcwe3-109170-5541726.pdf; ComponentLink22Description: https://datasheet.ciiva.com/5541/dcrcwe3-109170-5541726.pdf; Supplier Part Number 1: 541-1.00HHTR-ND
RFIO1 = SMA Straight PCB: RF Connector SMA Straight PCB Jack Surface Mount 50 Ohm; Part No: 132134-15
U1 = SX1211: SX1211I084